# EAGLE design ws2803.top (EAGLE 6.2)
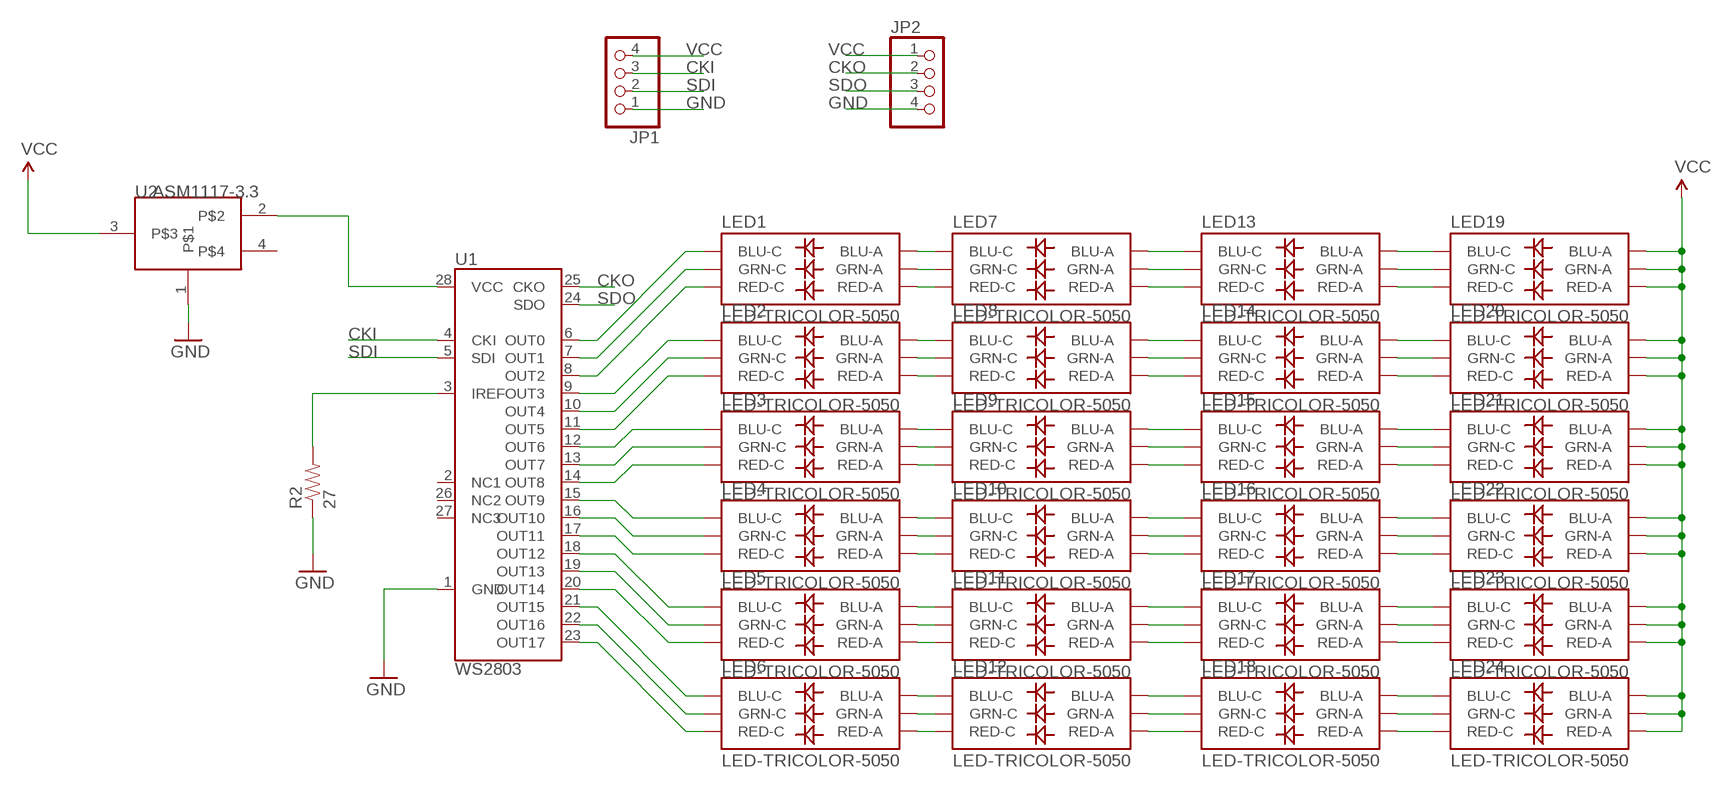
[diagram p0: schematic, sheet 1]

## Parts
JP1  PINHD-1X4  [1X04]
JP2  PINHD-1X4  [1X04]
LED1  LED-TRICOLOR-5050  [LED-TRICOLOR-5050]
LED2  LED-TRICOLOR-5050  [LED-TRICOLOR-5050]
LED3  LED-TRICOLOR-5050  [LED-TRICOLOR-5050]
LED4  LED-TRICOLOR-5050  [LED-TRICOLOR-5050]
LED5  LED-TRICOLOR-5050  [LED-TRICOLOR-5050]
LED6  LED-TRICOLOR-5050  [LED-TRICOLOR-5050]
LED7  LED-TRICOLOR-5050  [LED-TRICOLOR-5050]
LED8  LED-TRICOLOR-5050  [LED-TRICOLOR-5050]
LED9  LED-TRICOLOR-5050  [LED-TRICOLOR-5050]
LED10  LED-TRICOLOR-5050  [LED-TRICOLOR-5050]
LED11  LED-TRICOLOR-5050  [LED-TRICOLOR-5050]
LED12  LED-TRICOLOR-5050  [LED-TRICOLOR-5050]
LED13  LED-TRICOLOR-5050  [LED-TRICOLOR-5050]
LED14  LED-TRICOLOR-5050  [LED-TRICOLOR-5050]
LED15  LED-TRICOLOR-5050  [LED-TRICOLOR-5050]
LED16  LED-TRICOLOR-5050  [LED-TRICOLOR-5050]
LED17  LED-TRICOLOR-5050  [LED-TRICOLOR-5050]
LED18  LED-TRICOLOR-5050  [LED-TRICOLOR-5050]
LED19  LED-TRICOLOR-5050  [LED-TRICOLOR-5050]
LED20  LED-TRICOLOR-5050  [LED-TRICOLOR-5050]
LED21  LED-TRICOLOR-5050  [LED-TRICOLOR-5050]
LED22  LED-TRICOLOR-5050  [LED-TRICOLOR-5050]
LED23  LED-TRICOLOR-5050  [LED-TRICOLOR-5050]
LED24  LED-TRICOLOR-5050  [LED-TRICOLOR-5050]
R2  27  RESISTOR0603-RES  [0603-RES]
U1  WS2803  [SOP-28]
U2  ASM1117-3.3  [SOT223]

## Nets
CKI: JP1.3 U1.4(CKI)
CKO: JP2.2 U1.25(CKO)
GND: JP1.1 JP2.4 R2.1 U1.1(GND) U2.1
N$1: LED3.4(BLU-C) U1.12(OUT6)
N$2: LED3.6(GRN-C) U1.13(OUT7)
N$3: LED3.5(RED-C) U1.14(OUT8)
N$4: R2.2 U1.3(IREF)
N$5: LED4.4(BLU-C) U1.15(OUT9)
N$6: LED4.6(GRN-C) U1.16(OUT10)
N$7: LED4.5(RED-C) U1.17(OUT11)
N$8: LED5.4(BLU-C) U1.18(OUT12)
N$9: LED5.6(GRN-C) U1.19(OUT13)
N$10: LED5.5(RED-C) U1.20(OUT14)
N$11: LED6.4(BLU-C) U1.21(OUT15)
N$12: LED6.6(GRN-C) U1.22(OUT16)
N$13: LED6.5(RED-C) U1.23(OUT17)
N$14: LED2.5(RED-C) U1.11(OUT5)
N$15: LED2.6(GRN-C) U1.10(OUT4)
N$16: LED2.4(BLU-C) U1.9(OUT3)
N$17: LED1.5(RED-C) U1.8(OUT2)
N$18: LED1.6(GRN-C) U1.7(OUT1)
N$19: LED1.4(BLU-C) U1.6(OUT0)
N$20: LED1.3(BLU-A) LED7.4(BLU-C)
N$21: LED1.1(GRN-A) LED7.6(GRN-C)
N$22: LED1.2(RED-A) LED7.5(RED-C)
N$23: LED2.3(BLU-A) LED8.4(BLU-C)
N$24: LED2.1(GRN-A) LED8.6(GRN-C)
N$25: LED2.2(RED-A) LED8.5(RED-C)
N$26: LED3.3(BLU-A) LED9.4(BLU-C)
N$27: LED3.1(GRN-A) LED9.6(GRN-C)
N$28: LED3.2(RED-A) LED9.5(RED-C)
N$29: LED4.3(BLU-A) LED10.4(BLU-C)
N$30: LED4.1(GRN-A) LED10.6(GRN-C)
N$31: LED4.2(RED-A) LED10.5(RED-C)
N$32: LED5.3(BLU-A) LED11.4(BLU-C)
N$33: LED5.1(GRN-A) LED11.6(GRN-C)
N$34: LED5.2(RED-A) LED11.5(RED-C)
N$35: LED6.3(BLU-A) LED12.4(BLU-C)
N$36: LED6.1(GRN-A) LED12.6(GRN-C)
N$37: LED6.2(RED-A) LED12.5(RED-C)
N$38: LED12.3(BLU-A) LED18.4(BLU-C)
N$39: LED7.1(GRN-A) LED13.6(GRN-C)
N$40: LED7.2(RED-A) LED13.5(RED-C)
N$41: LED7.3(BLU-A) LED13.4(BLU-C)
N$42: LED8.3(BLU-A) LED14.4(BLU-C)
N$43: LED8.1(GRN-A) LED14.6(GRN-C)
N$44: LED8.2(RED-A) LED14.5(RED-C)
N$45: LED9.3(BLU-A) LED15.4(BLU-C)
N$46: LED9.1(GRN-A) LED15.6(GRN-C)
N$47: LED9.2(RED-A) LED15.5(RED-C)
N$48: LED10.3(BLU-A) LED16.4(BLU-C)
N$49: LED10.1(GRN-A) LED16.6(GRN-C)
N$50: LED10.2(RED-A) LED16.5(RED-C)
N$51: LED11.3(BLU-A) LED17.4(BLU-C)
N$52: LED11.1(GRN-A) LED17.6(GRN-C)
N$53: LED11.2(RED-A) LED17.5(RED-C)
N$54: LED12.2(RED-A) LED18.5(RED-C)
N$55: LED12.1(GRN-A) LED18.6(GRN-C)
N$56: LED18.1(GRN-A) LED24.6(GRN-C)
N$57: LED13.3(BLU-A) LED19.4(BLU-C)
N$58: LED13.1(GRN-A) LED19.6(GRN-C)
N$59: LED13.2(RED-A) LED19.5(RED-C)
N$60: LED14.3(BLU-A) LED20.4(BLU-C)
N$61: LED14.1(GRN-A) LED20.6(GRN-C)
N$62: LED14.2(RED-A) LED20.5(RED-C)
N$63: LED15.3(BLU-A) LED21.4(BLU-C)
N$64: LED15.1(GRN-A) LED21.6(GRN-C)
N$65: LED15.2(RED-A) LED21.5(RED-C)
N$66: LED16.3(BLU-A) LED22.4(BLU-C)
N$67: LED16.1(GRN-A) LED22.6(GRN-C)
N$68: LED16.2(RED-A) LED22.5(RED-C)
N$69: LED17.3(BLU-A) LED23.4(BLU-C)
N$70: LED17.1(GRN-A) LED23.6(GRN-C)
N$71: LED17.2(RED-A) LED23.5(RED-C)
N$72: LED18.3(BLU-A) LED24.4(BLU-C)
N$73: LED18.2(RED-A) LED24.5(RED-C)
SDI: JP1.2 U1.5(SDI)
SDO: JP2.3 U1.24(SDO)
VCC: JP1.4 JP2.1 LED19.1(GRN-A) LED19.2(RED-A) LED19.3(BLU-A) LED20.1(GRN-A) LED20.2(RED-A) LED20.3(BLU-A) LED21.1(GRN-A) LED21.2(RED-A) LED21.3(BLU-A) LED22.1(GRN-A) LED22.2(RED-A) LED22.3(BLU-A) LED23.1(GRN-A) LED23.2(RED-A) LED23.3(BLU-A) LED24.1(GRN-A) LED24.2(RED-A) LED24.3(BLU-A) U2.3
VCC1: U1.28(VCC) U2.2
Unconnected: U1.2(NC1) U1.26(NC2) U1.27(NC3) U2.4

## Library data of the parts
JP1 JP2 = pinhead:PINHD-1X4: PIN HEADER
LED1-LED24 = SparkFun:LED-TRICOLOR-5050
R2 = SparkFun:RESISTOR: Resistor Basic schematic elements and footprints for 0603, 1206, and PTH resistors.
U1 = WS2803:WS2803: WS2803 18 Channel Constant Current LED Driver with programmable PWM outputs.
U2 = Itead_IC_110429:ASM1117-3.3: ICP006

## Board
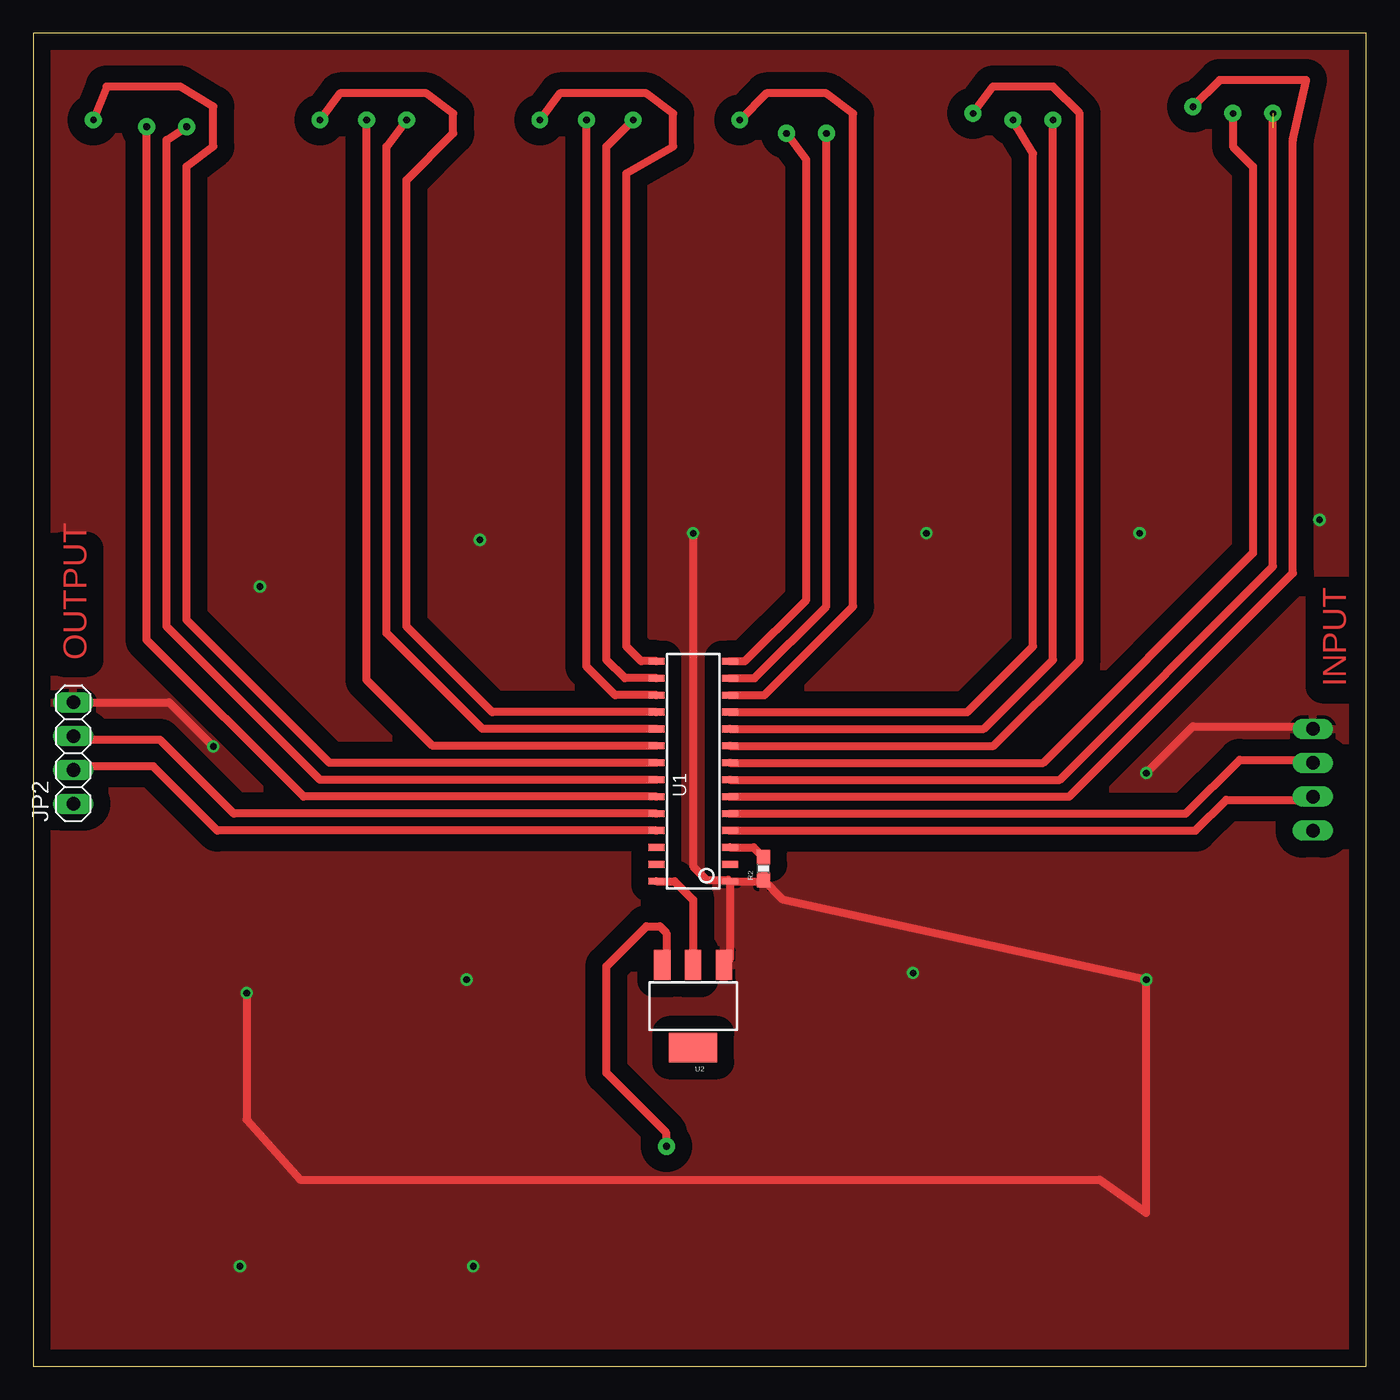
[diagram p1: board, top side]
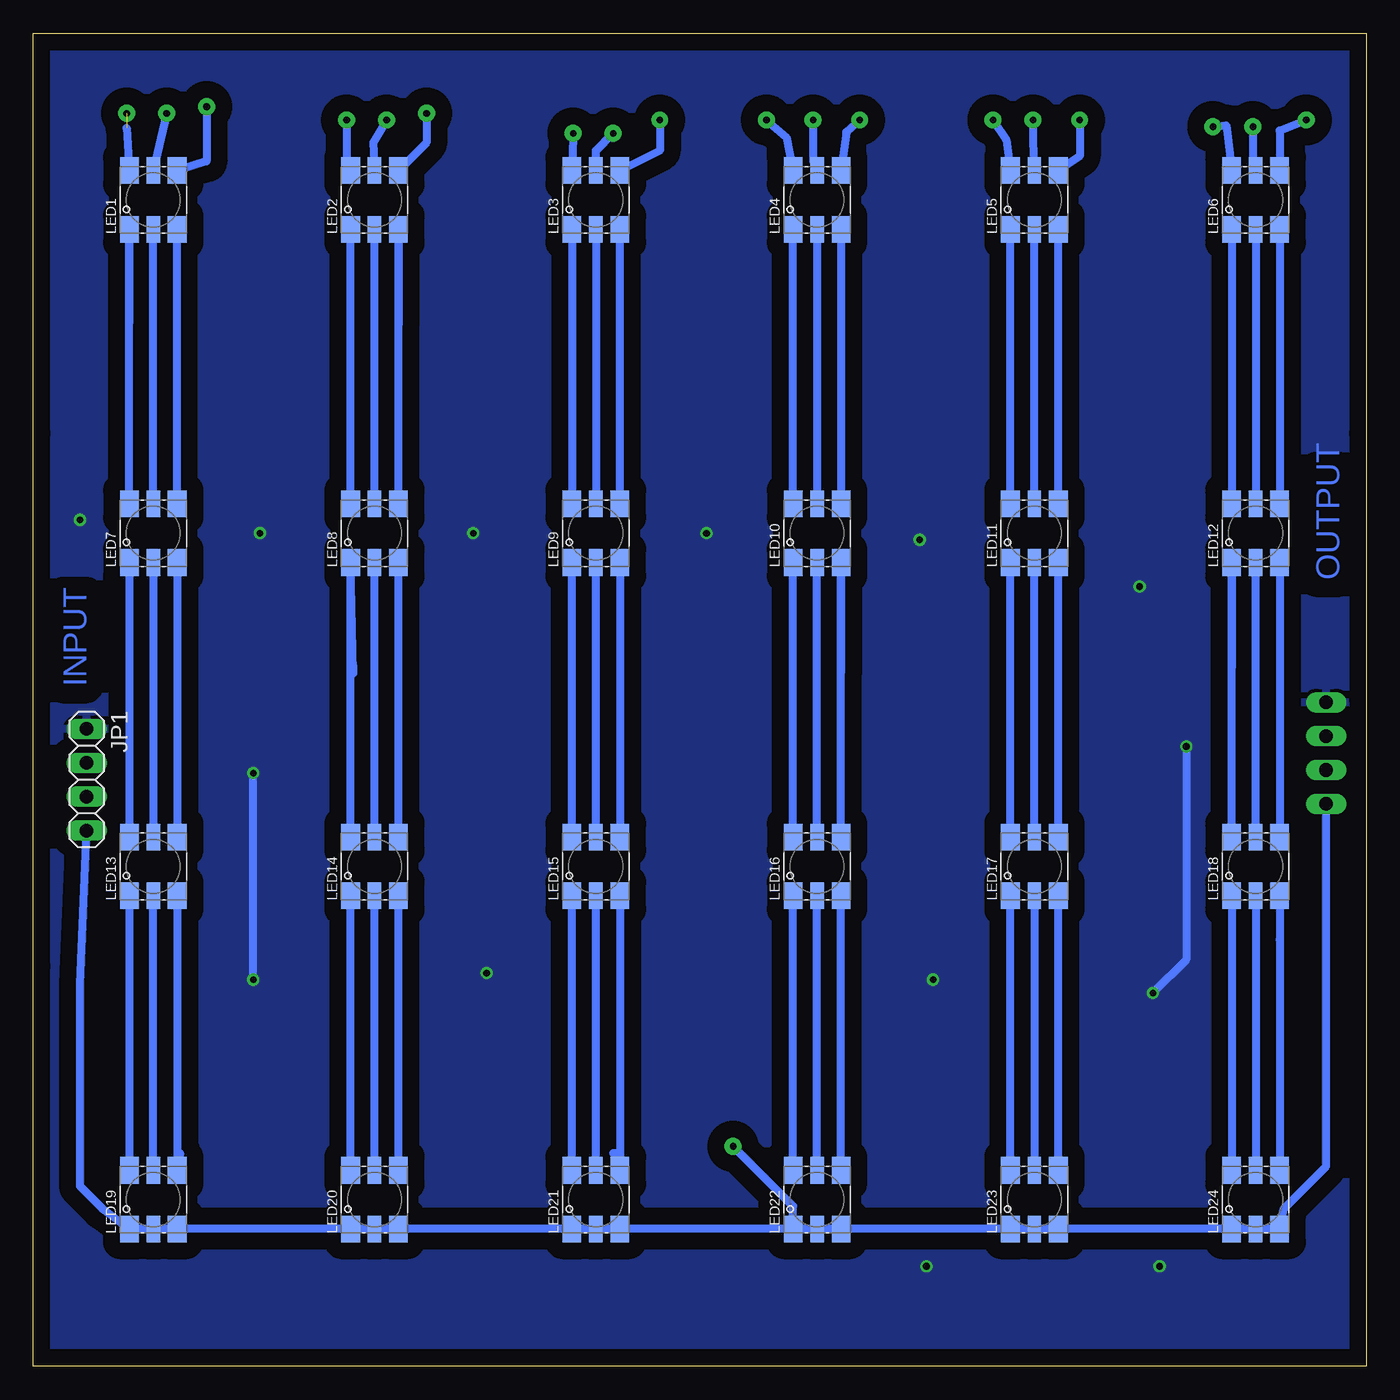
[diagram p2: board, bottom side, seen from below]

Size 100 x 100 mm. Coordinates in mm from the lower left corner, seen from the top.
Outline: 0,0 100,0 100,30 100,50 100,70 100,100 0,100 0,70 0,50 0,30 0,0
Copper layers (1*16): Top 0.035mm / dielectric 1.5mm / Bottom 0.035mm
Design rules: minimum track width 10mil, minimum drill 24mil, track to track 8mil, track to pad 8mil, pad to pad 8mil, via to via 8mil, smd to smd 8mil, copper to edge 40mil, drill to drill 8mil, minimum pad ring 10mil, minimum via ring 8mil, stop-mask expansion 4mil, vias tented up to drill 0mil, thermal gap 10mil

### Footprints (pad centres in the part's own frame; a part is rotated, then mirrored left to right if it is on the bottom)
1X04 = drill 1.016 long: 1 -3.81,0; 2 -1.27,0; 3 1.27,0; 4 3.81,0
LED-TRICOLOR-5050 = smd 2 x 1.4: 1 -2.2,1.8; 3 -2.2,-1.8; 4 2.2,-1.8; 6 2.2,1.8 | smd 2 x 1: 2 -2.2,0; 5 2.2,0
0603-RES = smd 1.1 x 1: 1 -0.85,0; 2 0.85,0
SOP-28 = smd 0.5 x 1.2: 1 -7.62,-2.75; 2 -6.35,-2.75; 3 -5.08,-2.75; 4 -3.81,-2.75; 5 -2.54,-2.75; 6 -1.27,-2.75; 7 0,-2.75; 8 1.27,-2.75; 9 2.54,-2.75; 10 3.81,-2.75; 11 5.08,-2.75; 12 6.35,-2.75; 13 7.62,-2.75; 14 8.89,-2.75; 15 8.89,2.75; 16 7.62,2.75; 17 6.35,2.75; 18 5.08,2.75; 19 3.81,2.75; 20 2.54,2.75; 21 1.27,2.75; 22 0,2.75; 23 -1.27,2.75; 24 -2.54,2.75; 25 -3.81,2.75; 26 -5.08,2.75; 27 -6.35,2.75; 28 -7.62,2.75
SOT223 = smd 1.219 x 2.235: 1 -2.311,-3.099; 2 0,-3.099; 3 2.311,-3.099 | smd 3.6 x 2.2: 4 0,3.099

### Placement (x,y rotation side)
JP1  96,44 270 bottom
JP2  3,46 90 top
LED1  91,87.5 90 bottom
LED2  74.4,87.5 90 bottom
LED3  57.8,87.5 90 bottom
LED4  41.2,87.5 90 bottom
LED5  24.9,87.5 90 bottom
LED6  8.3,87.5 90 bottom
LED7  91,62.5 90 bottom
LED8  74.4,62.5 90 bottom
LED9  57.8,62.5 90 bottom
LED10  41.2,62.5 90 bottom
LED11  24.9,62.5 90 bottom
LED12  8.3,62.5 90 bottom
LED13  91,37.5 90 bottom
LED14  74.4,37.5 90 bottom
LED15  57.8,37.5 90 bottom
LED16  41.2,37.5 90 bottom
LED17  24.9,37.5 90 bottom
LED18  8.3,37.5 90 bottom
LED19  91,12.5 90 bottom
LED20  74.4,12.5 90 bottom
LED21  57.8,12.5 90 bottom
LED22  41.2,12.5 90 bottom
LED23  24.9,12.5 90 bottom
LED24  8.3,12.5 90 bottom
R2  54.78,37.33 90 top
U1  49.5,44 90 top
U2  49.5,27 180 top

### Tracks (layer width: path | path; a pad name or v marks a point on that pad's centre or on a via)
CKI
  Top 0.61: U1.4 87.19,40.19 89.5,42.5 96,42.5 96.5,43 96.27,43 JP1.3
CKO
  Top 0.61: U1.25 13.81,40.19 9,45 3.27,45 JP2.2
GND  (via drill 0.5)
  Top 0.61: U1.1 52.25,30.54 U2.1 | U1.1 54.68,36.38 R2.1 56.26,35 v83.5,29 83.5,11.5 80,14 20,14 16,18.5 v16,28 | JP2.4 10.19,49.81 v13.5,46.5 | v83.5,44.5 87,48 95.81,48 JP1.1 | v49.5,62.5 49.5,37.5 50.5,36.5 52.13,36.5 U1.1
  Bottom 0.61: v13.5,46.5 13.5,30.5 v16,28 | v83.5,29 v83.5,44.5
  other vias: 66,29.5 67,62.5 32.5,29 33.5,62 17,58.5 83,62.5 96.5,63.5 15.5,7.5 33,7.5
  pour Top (isolate 1.27): 0,100 99.5,100 99.5,0 0,0
  pour Bottom (isolate 1.27): 0,100 100,100 100.5,0 0.5,0
N$1  (via drill 0.5 pad 1.27)
  Top 0.61: U1.12 54.85,50.35 61.5,57 61.5,94 59.5,95.5 55,95.5 v53,93.5
  Bottom 0.61: v53,93.5 53,91.2 LED3.4
N$2  (via drill 0.5 pad 1.27)
  Top 0.61: U1.13 54.12,51.62 59.5,57 v59.5,92.5
  Bottom 0.61: v59.5,92.5 59.5,92.3 LED3.6
N$3  (via drill 0.5 pad 1.27)
  Top 0.61: U1.14 53.39,52.89 58,57.5 58,90.5 v56.5,92.5
  Bottom 0.61: LED3.5 57.8,91.2 v56.5,92.5
N$4
  Top 0.61: U1.3 54.04,38.92 R2.2
N$5  (via drill 0.5 pad 1.27)
  Top 0.61: U1.15 45.61,52.89 44.5,54 44.5,89.5 48,91.5 48,94 46,95.5 39.5,95.5 v38,93.5
  Bottom 0.61: v38,93.5 39,92.6 LED4.4
N$6  (via drill 0.5 pad 1.27)
  Top 0.61: U1.16 44.38,51.62 43,53 43,91.5 v45,93.5
  Bottom 0.61: v45,93.5 43.5,92.2 LED4.6
N$7  (via drill 0.5 pad 1.27)
  Top 0.61: U1.17 43.65,50.35 41.5,52.5 v41.5,93.5
  Bottom 0.61: v41.5,93.5 41.5,90.5 LED4.5
N$8  (via drill 0.5 pad 1.27)
  Top 0.61: U1.18 34.42,49.08 28,55.5 28,89 31.5,92.5 31.5,94 29.5,95.5 23,95.5 v21.5,93.5
  Bottom 0.61: v21.5,93.5 21.5,90.8 LED5.4
N$9  (via drill 0.5 pad 1.27)
  Top 0.61: U1.19 33.69,47.81 26.5,55 26.5,91.5 v28,93.5
  Bottom 0.61: v28,93.5 27,92 LED5.6
N$10  (via drill 0.5 pad 1.27)
  Top 0.61: U1.20 29.96,46.54 25,51.5 v25,93.5
  Bottom 0.61: v25,93.5 25,91.8 LED5.5
N$11  (via drill 0.5 pad 1.27)
  Top 0.61: U1.21 22.23,45.27 11.5,56 11.5,90 13.5,91.5 13.5,94.5 11,96 5.5,96 v4.5,93.5
  Bottom 0.61: v4.5,93.5 6.5,92.7 LED6.4
N$12  (via drill 0.5 pad 1.27)
  Top 0.61: U1.22 21.5,44 10,55.5 10,92 v11.5,93
  Bottom 0.61: v11.5,93 10.5,93.1 LED6.6
N$13  (via drill 0.5 pad 1.27)
  Top 0.61: U1.23 20.27,42.73 8.5,54.5 v8.5,93
  Bottom 0.61: v8.5,93 8.5,89.9 LED6.5
N$14  (via drill 0.5 pad 1.27)
  Top 0.61: U1.11 70.08,49.08 75,54 75,91 v73.5,93.5
  Bottom 0.61: v73.5,93.5 74.5,91.8 LED2.5
N$15  (via drill 0.5 pad 1.27)
  Top 0.61: U1.10 71.31,47.81 76.5,53 v76.5,93.5
  Bottom 0.61: v76.5,93.5 76.5,90 LED2.6
N$16  (via drill 0.5 pad 1.27)
  Top 0.61: U1.9 72.04,46.54 78.5,53 78.5,94 76.5,96 72,96 v70.5,94
  Bottom 0.61: v70.5,94 70.5,91.8 LED2.4
N$17  (via drill 0.5 pad 1.27)
  Top 0.61: U1.8 75.77,45.27 91.5,61 91.5,90 90,91.5 v90,94
  Bottom 0.61: v90,94 LED1.5
N$18  (via drill 0.5 pad 1.27)  (1 unrouted)
  Top 0.61: U1.7 77,44 93,60 v93,94
  Bottom 0.61: 93,92.9 LED1.6
N$19  (via drill 0.5 pad 1.27)
  Top 0.61: U1.6 77.73,42.73 94.5,59.5 94.5,92 95.5,96.5 89,96.5 v87,94.5
  Bottom 0.61: v87,94.5 87,90.4 LED1.4
N$20
  Bottom 0.61: LED7.4 LED1.3
N$21
  Bottom 0.61: LED7.6 LED1.1 92.8,78.3
N$22
  Bottom 0.61: LED7.5 LED1.2
N$23
  Bottom 0.61: LED8.4 72.6,78.1 | 72.6,78.1 LED2.3 72.6,78.1
N$24
  Bottom 0.61: LED8.6 LED2.1
N$25
  Bottom 0.61: LED8.5 LED2.2
N$26
  Bottom 0.61: LED9.4 LED3.3
N$27
  Bottom 0.61: LED3.1 LED9.6
N$28
  Bottom 0.61: LED3.2 LED9.5
N$29
  Bottom 0.61: LED4.3 LED10.4
N$30
  Bottom 0.61: LED10.6 LED4.1
N$31
  Bottom 0.61: LED4.2 LED10.5
N$32
  Bottom 0.61: LED11.4 LED5.3
N$33
  Bottom 0.61: LED11.6 LED5.1
N$34
  Bottom 0.61: LED11.5 LED5.2
N$35
  Bottom 0.61: LED6.3 LED12.4
N$36
  Bottom 0.61: LED6.1 LED12.6
N$37
  Bottom 0.61: LED6.2 LED12.5
N$38
  Bottom 0.61: LED12.3 LED18.4
N$39
  Bottom 0.61: LED7.1 LED13.6
N$40
  Bottom 0.61: LED7.2 LED13.5
N$41
  Bottom 0.61: LED7.3 LED13.4
N$42
  Bottom 0.61: LED14.4 LED8.3
N$43
  Bottom 0.61: LED14.6 LED8.1 | LED8.1 76.2,52.3 76,52.5 76,52 LED8.1
N$44
  Bottom 0.61: LED14.5 LED8.2
N$45
  Bottom 0.61: LED9.3 LED15.4
N$46
  Bottom 0.61: LED15.6 LED9.1
N$47
  Bottom 0.61: LED15.5 LED9.2
N$48
  Bottom 0.61: LED16.4 39.4,52.1 | 39.4,52.1 LED10.3 39.4,52.1
N$49
  Bottom 0.61: LED16.6 LED10.1
N$50
  Bottom 0.61: LED16.5 LED10.2
N$51
  Bottom 0.61: LED17.4 LED11.3
N$52
  Bottom 0.61: LED17.6 LED11.1
N$53
  Bottom 0.61: LED17.5 LED11.2
N$54
  Bottom 0.61: LED18.5 LED12.2
N$55
  Bottom 0.61: LED18.6 LED12.1 10.1,52.4
N$56
  Bottom 0.61: LED18.1 LED24.6
N$57
  Bottom 0.61: LED13.3 LED19.4 | LED19.4 89.2,15.7 89,15.5 89,16 LED19.4
N$58
  Bottom 0.61: LED13.1 92.8,16.7 LED19.6
N$59
  Bottom 0.61: LED19.5 LED13.2
N$60
  Bottom 0.61: LED20.4 LED14.3
N$61
  Bottom 0.61: LED20.6 LED14.1
N$62
  Bottom 0.61: LED20.5 LED14.2
N$63
  Bottom 0.61: LED15.3 LED21.4 | LED21.4 56,15.5 56.5,16 56.2,16 LED21.4
N$64
  Bottom 0.61: LED21.6 LED15.1
N$65
  Bottom 0.61: LED21.5 LED15.2
N$66
  Bottom 0.61: LED22.4 LED16.3
N$67
  Bottom 0.61: LED22.6 LED16.1
N$68
  Bottom 0.61: LED22.5 LED16.2
N$69
  Bottom 0.61: LED23.4 LED17.3
N$70
  Bottom 0.61: LED23.6 LED17.1
N$71
  Bottom 0.61: LED17.2 LED23.5
N$72
  Bottom 0.61: LED18.3 6.5,32 LED24.4
N$73
  Bottom 0.61: LED18.2 LED24.5
SDI
  Top 0.61: U1.5 86.46,41.46 90.5,45.5 95.77,45.5 JP1.2
SDO
  Top 0.61: U1.24 15.04,41.46 9.5,47 3.27,47 JP2.3
VCC  (via drill 0.5 pad 1.27)
  Top 0.61: v47.5,16.5 47.5,17.5 43,22 43,30 46,33 47,33 47.5,32.5 47.5,30.41 U2.3
  Bottom 0.61: LED22.1 LED21.3 LED21.2 LED21.1 LED20.3 LED20.2 LED20.1 LED19.3 LED19.2 LED19.1 94.8,11.8 96.5,13.5 96.5,28.69 JP1.4 | JP2.1 3,15 6.2,11.8 LED24.3 LED24.2 LED24.1 LED23.3 LED23.2 LED23.1 LED22.3 LED22.2 LED22.1 | JP2.1 3,42.5 JP2.1 | LED22.1 43,12 v47.5,16.5
VCC1
  Top 0.61: U1.28 48.12,36.38 49.5,35 U2.2

### Text on the board
Top: OUTPUT | INPUT
Bottom: OUTPUT | INPUT